# EAGLE design Ambient_Board_v1.1b (EAGLE 6.4)

## Sheet 1 of 4
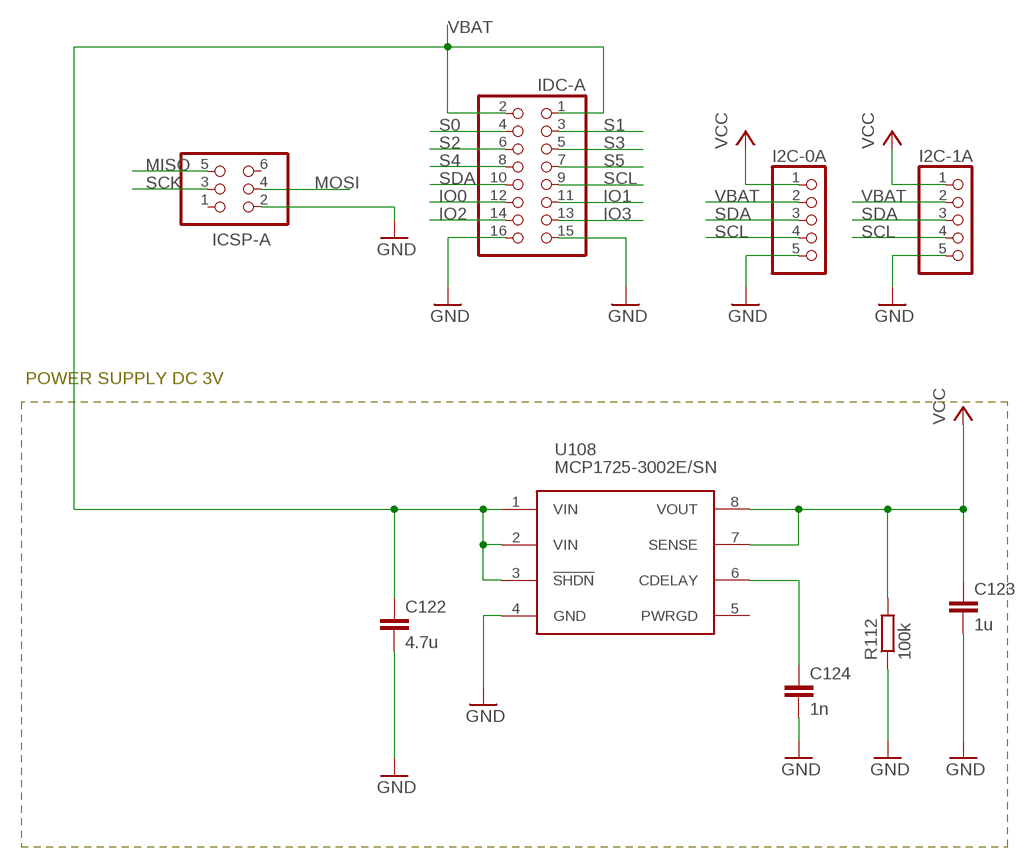
[diagram p0: schematic, sheet 1]

### Parts
C122  4.7u  C-EUC0805  [C0805]
C123  1u  C-EUC0805  [C0805]
C124  1n  C-EUC0603K  [C0603K]
I2C-0A  PINHD-1X5  [1X05]
I2C-1A  PINHD-1X5  [1X05]
ICSP-A  ICSP-A  PINHD-2X3  [2X03]
IDC-A  PINHD-2X8  [2X08]
R112  100k  R-EU_R0603  [R0603]
U108  MCP1725-3002E/SN  MCP1725  [SOIC8]

### Nets
GND: C122.2 C123.2 C124.2 I2C-0A.5 I2C-1A.5 ICSP-A.2 IDC-A.15 IDC-A.16 R112.1 U108.4(GND) ; also sheet 2,3,4
IO0: IDC-A.12 ; also sheet 3
IO1: IDC-A.11 ; also sheet 3
IO2: IDC-A.14 ; also sheet 3
IO3: IDC-A.13 ; also sheet 3
MISO: ICSP-A.5
MOSI: ICSP-A.4
N$9: C124.1 U108.6(CDELAY)
S0: IDC-A.4 ; also sheet 3
S1: IDC-A.3 ; also sheet 3
S2: IDC-A.6 ; also sheet 3
S3: IDC-A.5 ; also sheet 3
S4: IDC-A.8 ; also sheet 2
S5: IDC-A.7
SCK: ICSP-A.3
SCL: I2C-0A.4 I2C-1A.4 IDC-A.9 ; also sheet 2,3,4
SDA: I2C-0A.3 I2C-1A.3 IDC-A.10 ; also sheet 2,3,4
VBAT: C122.1 I2C-0A.2 I2C-1A.2 IDC-A.1 IDC-A.2 U108.1(VIN) U108.2(VIN) U108.3(!SHDN) ; also sheet 3
VCC [usbvcc]: C123.1 I2C-0A.1 I2C-1A.1 R112.2 U108.7(SENSE) U108.8(VOUT) ; also sheet 2,3,4
Unconnected: ICSP-A.1 ICSP-A.6 U108.5(PWRGD)

### Notes on the sheet
- POWER SUPPLY DC 3V

## Sheet 2 of 4
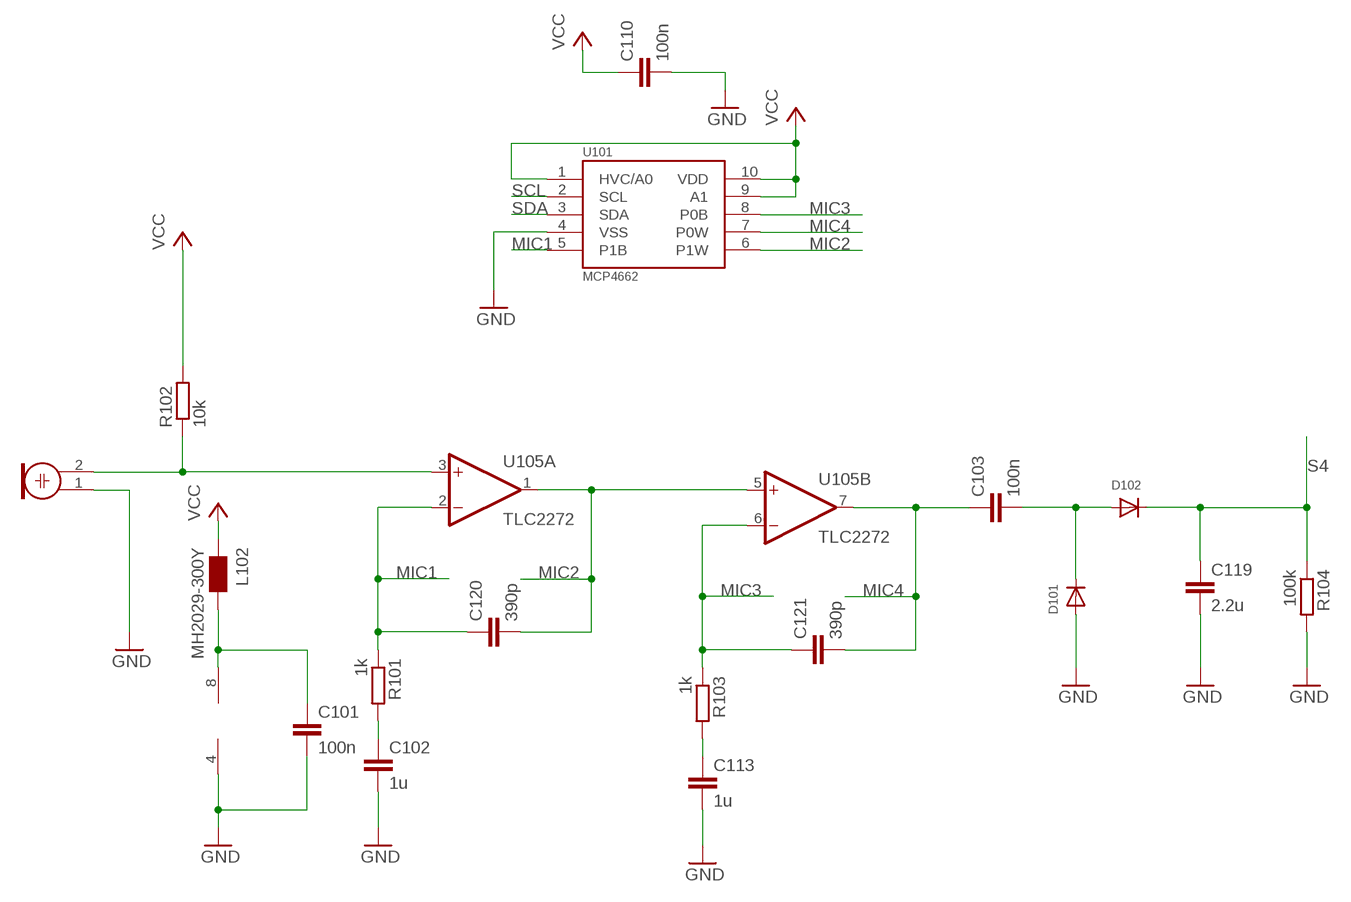
[diagram p1: schematic, sheet 2]

### Parts
C101  100n  C-EUC0603  [C0603]
C102  1u  C-EUC0805  [C0805]
C103  100n  C-EUC0603  [C0603]
C110  100n  C-EUC0603  [C0603]
C113  1u  C-EUC0805  [C0805]
C119  2.2u  C-EUC0805  [C0805]
C120  390p  C-EUC0603  [C0603]
C121  390p  C-EUC0603  [C0603]
D101  DIODESOD-323F  [SOD-323F]
D102  DIODESOD-323F  [SOD-323F]
L102  MH2029-300Y  WE-CBF_0805  [0805]
M101  POM-3044P-R  ELECTRET_MICROPHON-WM-63PR  [WM-63PR]
R101  1k  R-EU_R0603  [R0603]
R102  10k  R-EU_R0603  [R0603]
R103  1k  R-EU_R0603  [R0603]
R104  100k  R-EU_R0603  [R0603]
U101  MCP4662  [MSOP10]
U105  TLC2272  TL082D  [SO08]

### Nets
GND: C101.2 C102.2 C110.2 C113.2 C119.2 D101.A M101.1 R104.2 U101.4(VSS) U105.4(P:V-) ; also sheet 1,3,4
MIC1: C120.1 R101.1 U101.5(P1B) U105.2(A:-IN)
MIC2: C120.2 U101.6(P1W) U105.1(A:OUT) U105.5(B:+IN)
MIC3: C121.1 R103.1 U101.8(P0B) U105.6(B:-IN)
MIC4: C103.1 C121.2 U101.7(P0W) U105.7(B:OUT)
N$1: M101.2 R102.1 U105.3(A:+IN)
N$2: C102.1 R101.2
N$3: C103.2 D101.C D102.A
N$6 [usbvcc]: C101.1 L102.2 U105.8(P:V+)
N$16: C113.1 R103.2
S4: C119.1 D102.C R104.1 ; also sheet 1
SCL: U101.2(SCL) ; also sheet 1,3,4
SDA: U101.3(SDA) ; also sheet 1,3,4
VCC [usbvcc]: C110.1 L102.1 R102.2 U101.1(HVC/A0) U101.9(A1) U101.10(VDD) ; also sheet 1,3,4

## Sheet 3 of 4
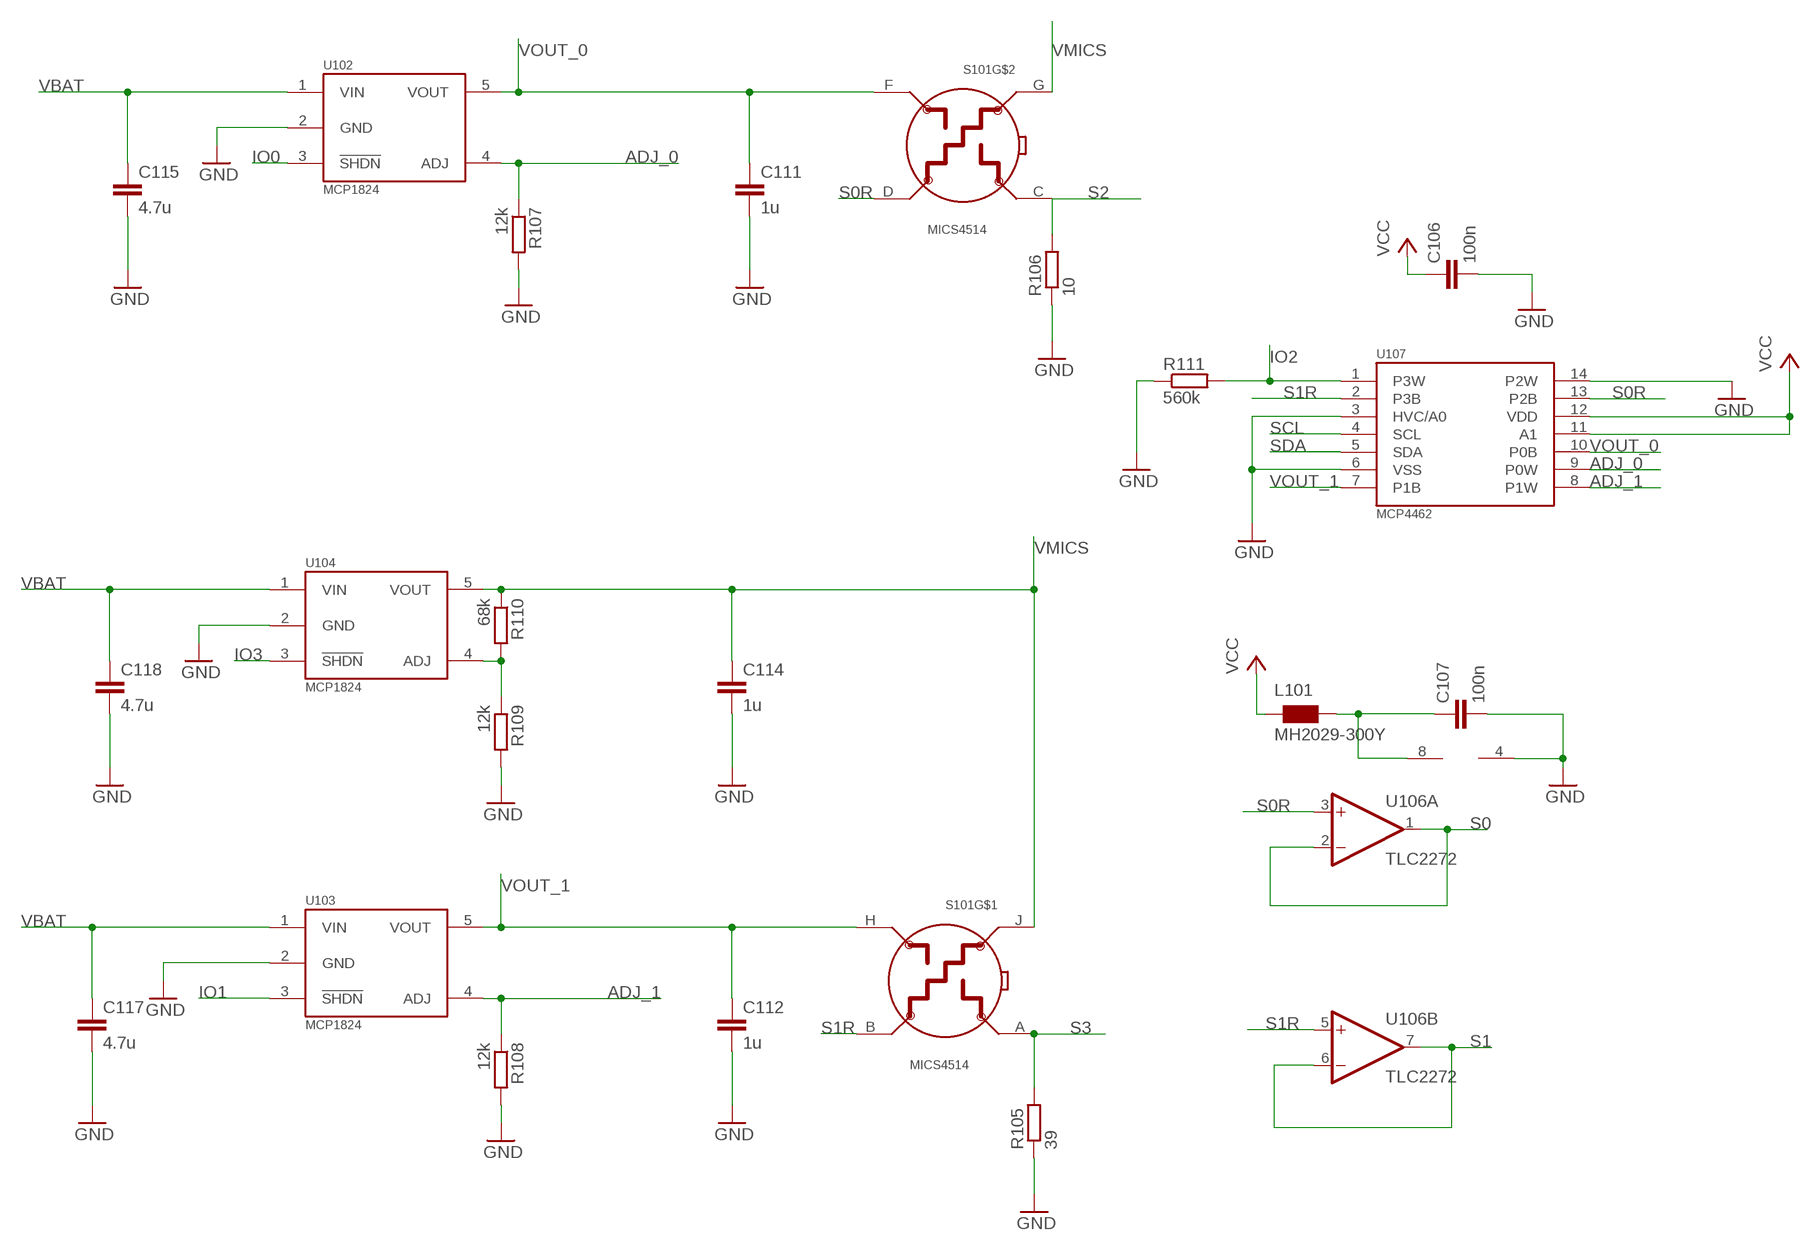
[diagram p2: schematic, sheet 3]

### Parts
C106  100n  C-EUC0603  [C0603]
C107  100n  C-EUC0603  [C0603]
C111  1u  C-EUC0805  [C0805]
C112  1u  C-EUC0805  [C0805]
C114  1u  C-EUC0805  [C0805]
C115  4.7u  C-EUC0805  [C0805]
C117  4.7u  C-EUC0805  [C0805]
C118  4.7u  C-EUC0805  [C0805]
L101  MH2029-300Y  WE-CBF_0805  [0805]
R105  39  R-EU_R0603  [R0603]
R106  10  R-EU_R0603  [R0603]
R107  12k  R-EU_R0603  [R0603]
R108  12k  R-EU_R0603  [R0603]
R109  12k  R-EU_R0603  [R0603]
R110  68k  R-EU_R0603  [R0603]
R111  560k  R-EU_R0603  [R0603]
S101  MICS4514  [MICS_SMD]
U102  MCP1824  TC1071  [SOT23-5L]
U103  MCP1824  TC1071  [SOT23-5L]
U104  MCP1824  TC1071  [SOT23-5L]
U106  TLC2272  TL082D  [SO08]
U107  MCP4462  [TSSOP14]

### Nets
ADJ_0: R107.1 U102.4(ADJ) U107.9(P0W)
ADJ_1: R108.1 U103.4(ADJ) U107.8(P1W)
GND: C106.2 C107.2 C111.2 C112.2 C114.2 C115.2 C117.2 C118.2 R105.1 R106.1 R107.2 R108.2 R109.2 R111.1 U102.2(GND) U103.2(GND) U104.2(GND) U106.4(P:V-) U107.3(HVC/A0) U107.6(VSS) U107.14(P2W) ; also sheet 1,2,4
IO0: U102.3(!SHDN) ; also sheet 1
IO1: U103.3(!SHDN) ; also sheet 1
IO2: R111.2 U107.1(P3W) ; also sheet 1
IO3: U104.3(!SHDN) ; also sheet 1
N$7 [usbvcc]: C107.1 L101.2 U106.8(P:V+)
N$11: R109.1 R110.2 U104.4(ADJ)
S0: U106.1(A:OUT) U106.2(A:-IN) ; also sheet 1
S0R: S101.D U106.3(A:+IN) U107.13(P2B)
S1: U106.6(B:-IN) U106.7(B:OUT) ; also sheet 1
S1R: S101.B U106.5(B:+IN) U107.2(P3B)
S2: R106.2 S101.C ; also sheet 1
S3: R105.2 S101.A ; also sheet 1
SCL: U107.4(SCL) ; also sheet 1,2,4
SDA: U107.5(SDA) ; also sheet 1,2,4
VBAT: C115.1 C117.1 C118.1 U102.1(VIN) U103.1(VIN) U104.1(VIN) ; also sheet 1
VCC [usbvcc]: C106.1 L101.1 U107.11(A1) U107.12(VDD) ; also sheet 1,2,4
VMICS: C114.1 R110.1 S101.G S101.J U104.5(VOUT)
VOUT_0: C111.1 S101.F U102.5(VOUT) U107.10(P0B)
VOUT_1: C112.1 S101.H U103.5(VOUT) U107.7(P1B)

## Sheet 4 of 4
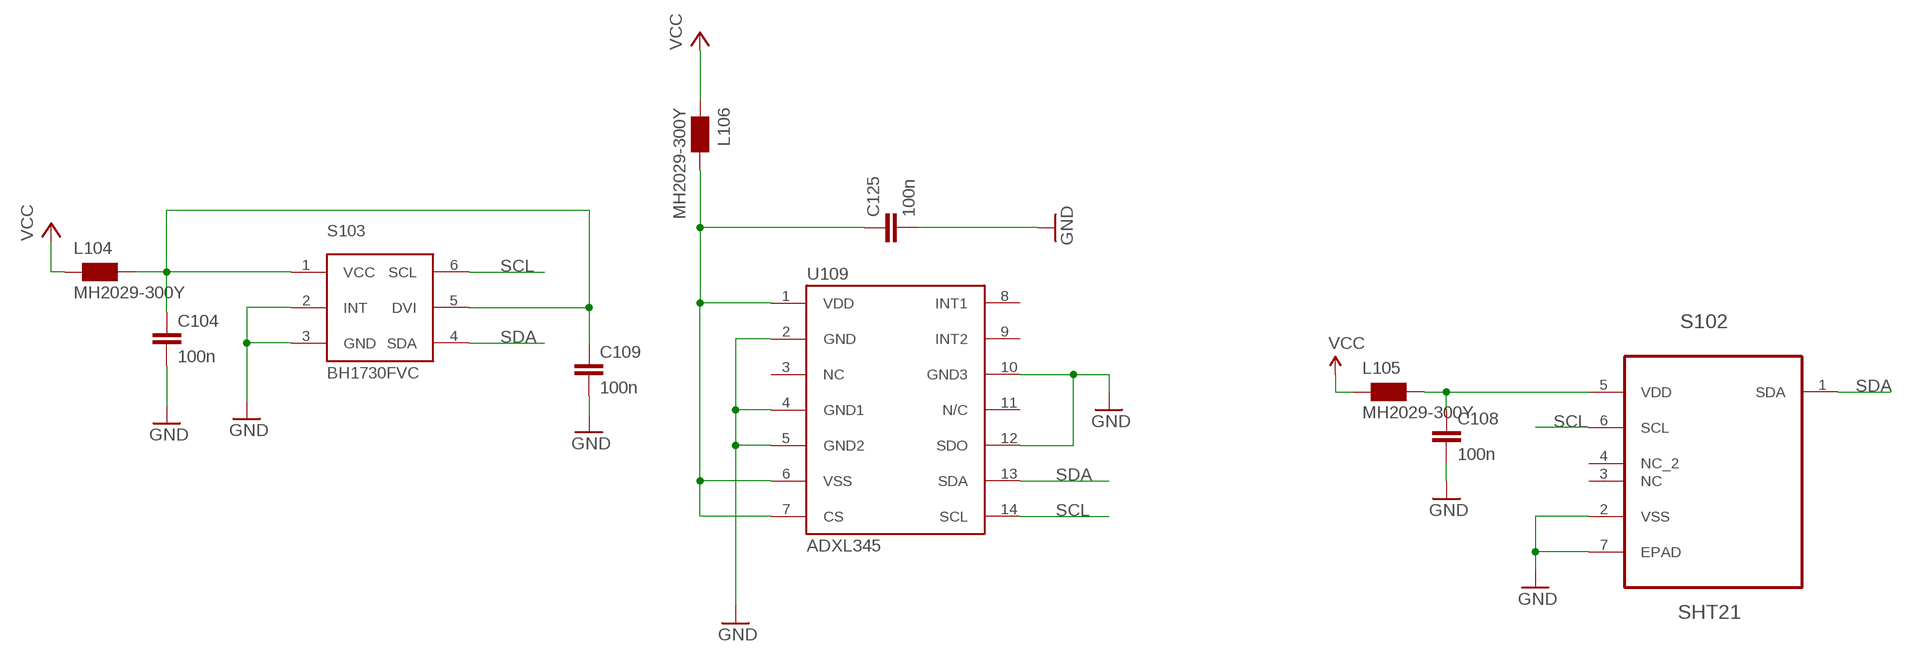
[diagram p3: schematic, sheet 4]

### Parts
C104  100n  C-EUC0603  [C0603]
C108  100n  C-EUC0603  [C0603]
C109  100n  C-EUC0603  [C0603]
C125  100n  C-EUC0603  [C0603]
L104  MH2029-300Y  WE-CBF_0805  [0805]
L105  MH2029-300Y  WE-CBF_0805  [0805]
L106  MH2029-300Y  WE-CBF_0805  [0805]
S102  SHT21  [DFN300X300X110-7N]
S103  BH1730FVC  [WSOF6]
U109  ADXL345  [LGA14]

### Nets
GND: C104.2 C108.2 C109.2 C125.2 S102.2(VSS) S102.7(EPAD) S103.2(INT) S103.3(GND) U109.2(GND) U109.4(GND1) U109.5(GND2) U109.10(GND3) U109.12(SDO) ; also sheet 1,2,3
N$4 [usbvcc]: C125.1 L106.2 U109.1(VDD) U109.6(VSS) U109.7(CS)
N$5 [usbvcc]: C108.1 L105.2 S102.5(VDD)
N$13 [usbvcc]: C104.1 C109.1 L104.2 S103.1(VCC) S103.5(DVI)
SCL: S102.6(SCL) S103.6(SCL) U109.14(SCL) ; also sheet 1,2,3
SDA: S102.1(SDA) S103.4(SDA) U109.13(SDA) ; also sheet 1,2,3
VCC [usbvcc]: L104.1 L105.1 L106.1 ; also sheet 1,2,3
Unconnected: S102.3(NC) S102.4(NC_2) U109.3(NC) U109.8(INT1) U109.9(INT2) U109.11(N/C)

## Library data of the parts
C101-C104 C106-C115 C117-C125 = rcl:C-EU: CAPACITOR, European symbol
D101 D102 = adafruit:DIODE: Diode SMADIODE - SMA Surface Mount Package 20V 1A Schottky Diode Digikey: 641-1014-6-ND DO-1N4148 - Through Hole Small Current Diode SOD-123 20V 1 A (.5mV Vf) Schottky Diode - Digikey: MBRX120TPMSCT-ND SOD-323 10V 570mA (.38mV Vf, 3ns) Schottky Diode - Digikey: ZLLS410CT-ND SOD-523 30V 30mA Schottky Diode (RB751S-40TE61) - Digikey: RB751S-40TE61CT-ND SOT23-R/W - SOT23 Package (R = Solder Paste/Reflow Ovens, W = Hand-Soldering) BAT54Film 40V 300mA - Digikey: 497-7162-1-ND
I2C-0A I2C-1A = pinhead:PINHD-1X5: PIN HEADER
ICSP-A = SmartPrj:PINHD-2X3: PIN HEADER
IDC-A = pinhead:PINHD-2X8: PIN HEADER
L101 L102 L104-L106 = wuerth-elektronik:WE-CBF: SMD EMI Suppression Ferrite Beads - excellent anti-EMI properties - low DCR - impedances till 3000 ohms - rated current up to 6 A
M101 = microphon:ELECTRET_MICROPHON-: Electret Condenser Microphone
R101-R112 = rcl:R-EU_: RESISTOR, European symbol
S101 = Hangar:MICS4514
S102 = Hangar:SHT21: SENSOR, HUMIDITY & TEMP; MPN: SHT21; OC_FARNELL: 1855468; OC_NEWARK: 20T1172; PACKAGE: DFN-6; SUPPLIER: SENSIRION
S103 = Hangar:BH1730FVC
U101 = Hangar:MCP4662
U102-U104 = Hangar:TC1071
U105 U106 = linear:TL082: OP AMP
U107 = Hangar:MCP4462
U108 = Hangar:MCP1725
U109 = SparkFunEagle-3-30-09:ADXL345

## Net classes
0 Default: width 0.203 mm
1 power: width 0.254 mm, drill 0.6 mm, clearance 0.203 mm
2 gnd: width 0.254 mm, drill 0.6 mm, clearance 0.203 mm
3 usbvcc: width 0.254 mm, drill 0.6 mm, clearance 0.203 mm
4 aref: width 0.254 mm, drill 0.6 mm, clearance 0.203 mm

## Board
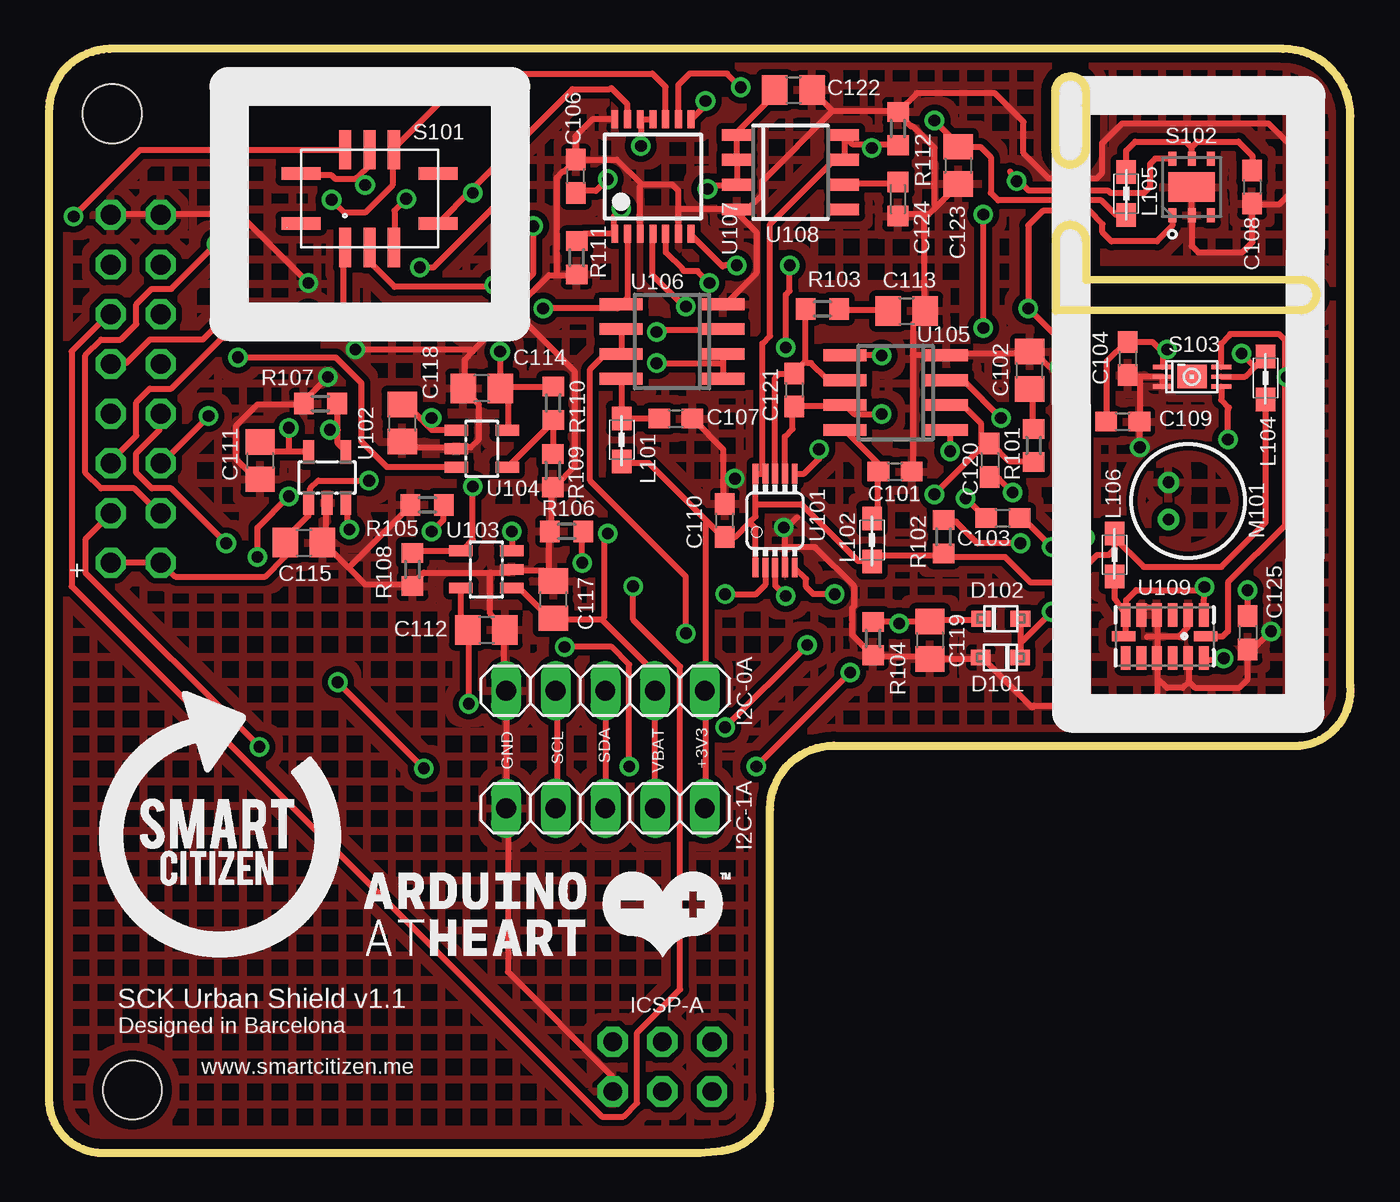
[diagram p4: board, top side]
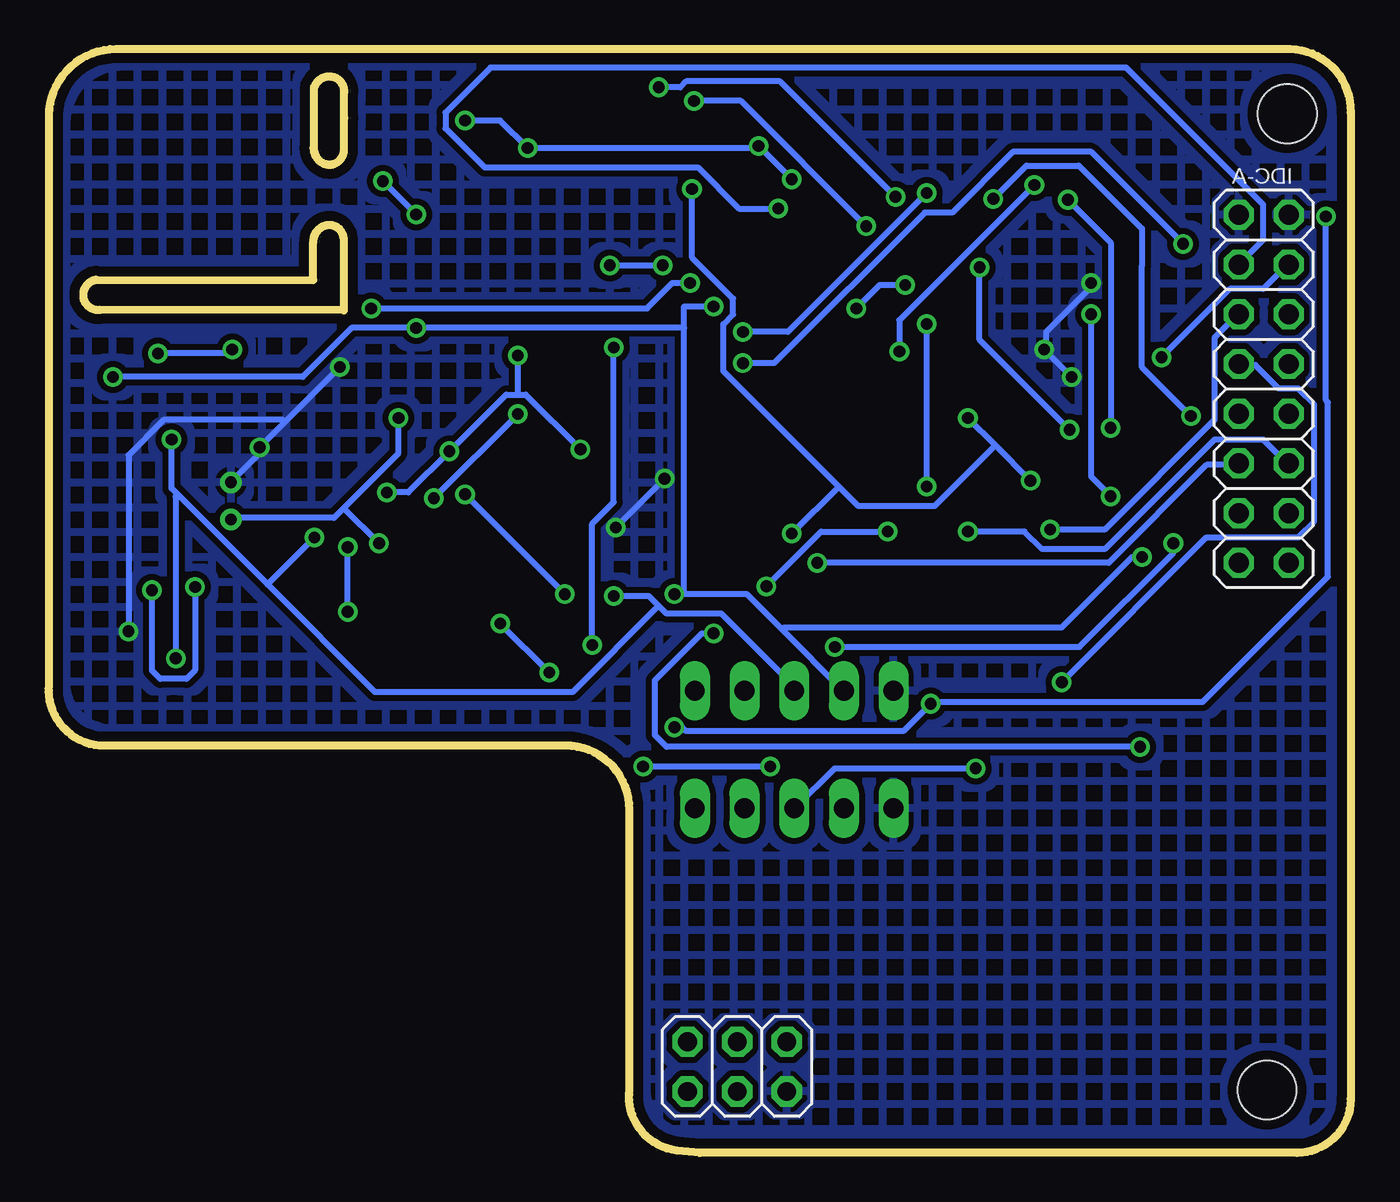
[diagram p5: board, bottom side, seen from below]

Size 66.53 x 56.41 mm. Coordinates in mm from the lower left corner, seen from the top.
Outline: 2.74,0 33.26,0 34.44,0.12 arc90 36.86,3.23 36.86,17.55 arc-90 40.12,20.81 63.95,20.81 arc90 66.52,23.89 66.52,52.98 arc90 63.09,56.41 3.09,56.41 arc90 0,53.15 0,2.74 arc90 2.74,0
Outline: 53,54.31 52.99,53.52 53.01,51.35 53,51.32 arc-90 52.14,50.49 arc-90 51.46,51.34 51.45,51.35 51.44,52.87 51.45,54.14 arc-90 52.11,55 arc-90 53,54.31
Outline: 64.09,44.61 53.02,44.6 53.02,46.55 53.01,46.59 arc90 52.15,47.42 arc90 51.47,46.56 51.47,46.56 51.47,43.05 63.92,43.07 arc90 64.78,43.76 arc90 64.09,44.61
Copper layers (1*16): Top 0.035mm / dielectric 1.5mm / Bottom 0.035mm
Design rules "default *": minimum track width 12mil, minimum drill 0.6mm, track to track 12mil, track to pad 12mil, pad to pad 8mil, via to via 6mil, smd to smd 8mil, copper to edge 20mil, drill to drill 1mm, minimum pad ring 10mil, minimum via ring 0.2mm, stop-mask expansion 4mil, vias tented up to drill 0mil, thermal gap 10mil
Holes 3 mm at 3.24,53.1 4.27,3.21

### Footprints (pad centres in the part's own frame; a part is rotated, then mirrored left to right if it is on the bottom)
C0603 = smd 1.1 x 1: 1 -0.85,0; 2 0.85,0
C0805 = smd 1.3 x 1.5: 1 -0.95,0; 2 0.95,0
C0603K = smd 1.05 x 1.08: 1 -0.875,0; 2 0.875,0
SOD-323F = smd 1 x 0.8: A -1,0; C 1,0
1X05 = drill 1.016 long: 1 -5.08,0; 2 -2.54,0; 3 0,0; 4 2.54,0; 5 5.08,0
2X03 = drill 0.95 pad 1.55 octagon: 1 -2.54,-1.27; 2 -2.54,1.27; 3 0,-1.27; 4 0,1.27; 5 2.54,-1.27; 6 2.54,1.27
2X08 = drill 1.016 octagon: 1 -8.89,-1.27; 2 -8.89,1.27; 3 -6.35,-1.27; 4 -6.35,1.27; 5 -3.81,-1.27; 6 -3.81,1.27; 7 -1.27,-1.27; 8 -1.27,1.27; 9 1.27,-1.27; 10 1.27,1.27; 11 3.81,-1.27; 12 3.81,1.27; 13 6.35,-1.27; 14 6.35,1.27; 15 8.89,-1.27; 16 8.89,1.27
0805 = smd 1.2 x 1: 1 -1.1,0; 2 1.1,0
WM-63PR = drill 0.6 pad 1: 1 -1,0.95; 2 -1,-0.95
R0603 = smd 1 x 1.1: 1 -0.85,0; 2 0.85,0
MICS_SMD = smd 0.635 x 2: A 1.25,2.5; B 0,2.5; C -1.25,2.5; F -1.25,-2.5; G 0,-2.5; H 1.25,-2.5 | smd 2 x 0.635: D -3.5,1.27; E -3.5,-1.27; J 3.5,-1.27; K 3.5,1.27
DFN300X300X110-7N = smd 0.711 x 0.406: 1 -1.448,0.991; 2 -1.448,0; 3 -1.448,-0.991; 4 1.448,-0.991; 5 1.448,0; 6 1.448,0.991 | smd 1.499 x 2.388: 7 0,0
WSOF6 = smd 0.22 x 1: 1 -0.5,-1.5; 2 0,-1.5; 3 0.5,-1.5; 4 0.5,1.5; 5 0,1.5; 6 -0.5,1.5 | smd 1.2 x 1.5: P$1 0,0
MSOP10 = smd 0.3 x 1.02: 1 -1,-2.4; 2 -0.5,-2.4; 3 0,-2.4; 4 0.5,-2.4; 5 1,-2.4; 6 1,2.4; 7 0.5,2.4; 8 0,2.4; 9 -0.5,2.4; 10 -1,2.4
SOT23-5L = smd 0.55 x 1.2: 1 -0.95,-1.3; 2 0,-1.3; 3 0.95,-1.3; 4 0.95,1.3; 5 -0.95,1.3
SO08 = smd 0.6 x 2.2: 1 -1.905,-2.6; 2 -0.635,-2.6; 3 0.635,-2.6; 4 1.905,-2.6; 5 1.905,2.6; 6 0.635,2.6; 7 -0.635,2.6; 8 -1.905,2.6
TSSOP14 = smd 0.35 x 0.9: 1 -1.95,-2.925; 2 -1.3,-2.925; 3 -0.65,-2.925; 4 0,-2.925; 5 0.65,-2.925; 6 1.3,-2.925; 7 1.95,-2.925; 8 1.95,2.925; 9 1.3,2.925; 10 0.65,2.925; 11 0,2.925; 12 -0.65,2.925; 13 -1.3,2.925; 14 -1.95,2.925
SOIC8 = smd 0.6 x 1.5: 1 -1.905,-2.75; 2 -0.635,-2.75; 3 0.635,-2.75; 4 1.905,-2.75; 5 1.905,2.75; 6 0.635,2.75; 7 -0.635,2.75; 8 -1.905,2.75
LGA14 = smd 0.5 x 1.2: 1 2,1.1; 2 1.2,1.1; 3 0.4,1.1; 4 -0.4,1.1; 5 -1.2,1.1; 6 -2,1.1; 8 -2,-1.1; 9 -1.2,-1.1; 10 -0.4,-1.1; 11 0.4,-1.1; 12 1.2,-1.1; 13 2,-1.1 | smd 1.2 x 0.5: 7 -2.1,0; 14 2.1,0

### Placement (x,y rotation side)
C101  43.25,34.81 0 top
C102  50.13,39.99 90 top
C103  48.76,32.44 0 top
C104  55.14,40.59 270 top
C106  26.94,49.91 90 top
C107  32.04,37.52 0 top
C108  61.5,49.36 270 top
C109  54.89,37.37 0 top
C110  34.55,32.31 90 top
C111  10.8,35.37 270 top
C112  22.36,26.72 0 top
C113  43.84,43.02 0 top
C114  22.13,39.06 180 top
C115  13.03,31.18 0 top
C117  25.79,28.27 90 top
C118  18.06,37.29 270 top
C119  45.03,26.2 270 top
C120  48.09,35.39 270 top
C121  38.09,38.98 270 top
C122  38.06,54.31 0 top
C123  46.48,50.46 270 top
C124  43.4,48.73 270 top
C125  61.27,26.58 270 top
D101  48.63,25.31 0 top
D102  48.65,27.29 180 top
I2C-0A  28.44,23.61 180 top
I2C-1A  28.44,17.61 180 top
ICSP-A  31.35,4.41 180 bottom
IDC-A  4.44,39.04 90 bottom
L101  29.27,36.43 90 top
L102  42.08,31.31 90 top
L104  62.19,39.6 90 top
L105  55.07,49.01 90 top
L106  54.47,30.56 270 top
M101  58.23,33.31 0 top
R101  50.33,36.14 90 top
R102  45.73,31.48 270 top
R103  39.54,43.12 0 top
R104  42.13,26.28 270 top
R105  19.34,33.11 0 top
R106  26.46,31.76 0 top
R107  13.88,38.28 180 top
R108  18.59,29.81 270 top
R109  25.76,34.86 270 top
R110  25.78,38.31 270 top
R111  26.98,45.74 90 top
R112  43.4,52.33 270 top
S101  16.39,48.76 180 top
S102  58.41,49.35 90 top
S103  58.43,39.66 270 top
U101  37.12,32.31 0 top
U102  14.22,34.51 0 top
U103  22.36,29.81 90 top
U104  22.13,35.98 270 top
U105  43.28,38.84 90 top
U106  31.85,41.46 90 top
U107  30.88,49.89 0 top
U108  37.91,50.11 270 top
U109  57.03,26.39 0 top

### Tracks (layer width: path | path; a pad name or v marks a point on that pad's centre or on a via)
ADJ_0  (via drill 0.6)
  Top 0.305: U107.9 32.18,54.57 32.76,55.15 34.66,55.15 v35.36,54.45 | 14.76,36.95 14.76,36.25 15.16,35.85 U102.4 | 14.76,36.95 14.76,38.25 R107.1 | v23.26,48.85 19.66,45.25 v18.96,45.25 | 14.76,36.95 v14.36,36.95
  Bottom 0.305: v35.36,54.45 34.26,54.45 33.96,54.75 29.16,54.75 v23.26,48.85 | v18.96,45.25 18.96,41.55 v14.36,36.95
ADJ_1  (via drill 0.6)
  Top 0.305: U107.8 32.84,52.81 33.67,53.64 v33.56,53.75 | R108.1 18.66,30.75 20.96,30.75 U103.4 21.16,30.85 21.66,31.35 v21.66,34.05 | v24.76,47.35 24.76,44.95 22.16,42.35 v21.66,42.35
  Bottom 0.305: v33.56,53.75 31.16,53.75 v24.76,47.35 | v21.66,34.05 v21.66,42.35
GND  (via drill 0.6)
  Top 0.305: U101.4 37.62,30.95 | 37.62,30.95 37.62,31.86 | 37.62,31.86 38.24,32.48 | U107.14 27.79,52.81 26.92,51.94 26.92,50.78 C106.2 | C106.2 29.01,50.76 30.29,49.48 | U107.3 30.23,49.42 30.29,49.48 | U107.6 32.18,48.25 | 32.18,48.25 32.18,49.16 31.86,49.47 30.3,49.47 30.29,49.48 | 34.46,34.45 34.46,35.95 32.96,37.45 C107.2 | 34.46,34.45 34.46,33.25 C110.2 | 37.62,30.95 39.16,30.95 41.16,28.95 41.16,27.95 41.06,27.85 41.06,26.45 42.06,25.45 R104.2 42.16,25.35 44.96,25.35 C119.2 45.06,25.25 47.56,25.25 D101.A 47.76,25.25 50.26,22.75 50.36,22.85 56.06,22.85 56.66,23.45 56.66,24.26 | v35.06,34.45 34.46,34.45 | v37.56,31.95 37.62,31.86 | 40.06,53.25 43.36,53.25 R112.1 | 40.06,53.25 39.06,54.25 C122.2 | 44.76,47.95 44.96,47.95 45.36,48.35 | 44.76,47.95 43.46,47.95 C124.2 | 45.36,48.35 46.46,49.45 C123.2 46.56,49.35 | 44.16,40.75 44.16,42.35 44.76,42.95 C113.2 44.76,43.15 44.76,47.95 | 44.16,40.75 44.16,34.85 C101.2 | R112.1 43.46,53.05 44.06,52.45 44.16,52.45 45.26,51.35 45.26,48.45 45.36,48.35 | C102.2 50.06,40.85 45.96,40.85 U105.4 45.76,40.75 44.16,40.75 | 50.36,40.95 50.26,40.95 C102.2 | 15.31,29.9 14.06,31.15 C115.2 14.16,31.25 14.16,33.15 U102.2 | 15.31,29.9 16.16,29.05 18.56,29.05 R108.2 18.66,29.15 19.16,29.65 22.56,29.65 | 15.31,29.9 18.46,33.05 R105.1 | 22.56,29.65 23.56,29.65 U103.2 23.66,29.75 25.26,29.75 25.76,29.25 C117.2 25.56,29.65 25.56,31.65 R106.1 25.66,31.85 25.66,33.95 R109.2 25.86,34.05 26.86,35.05 26.86,39.95 23.76,43.05 | ICSP-A.2 28.76,3.15 28.76,3.95 23.46,9.25 23.46,17.55 I2C-1A.5 23.36,17.65 23.36,23.45 I2C-0A.5 23.26,23.65 23.26,26.65 C112.2 23.26,26.85 22.56,27.55 22.56,29.65
  Top 0.305: IDC-A.15 3.26,47.95 5.66,47.95 IDC-A.16 5.86,47.95 9.76,47.95 v13.26,44.45 | C111.2 10.76,34.45 10.56,34.45 9.56,35.45 9.56,37.15 10.66,38.25 12.96,38.25 R107.2 13.16,38.35 13.16,38.55 v14.26,39.65 | C118.2 18.06,36.25 18.26,36.05 20.76,36.05 U104.2 20.96,36.05 21.56,36.05 21.96,36.45 21.96,38.25 21.26,38.95 C114.2 21.26,39.15 21.26,40.55 21.66,40.95 | 32.18,48.25 35.06,48.25 U108.4 | 25.96,44.85 25.56,44.85 23.76,43.05 | 25.96,44.85 26.96,44.85 R111.1 | 21.66,40.95 23.76,43.05 | 25.96,44.85 25.96,49.85 26.26,50.15 26.36,50.15 26.86,50.65 C106.2 | U106.4 34.46,43.45 34.66,43.45 36.16,44.95 36.16,47.05 35.16,48.05 U108.4 | v15.66,41.05 21.56,41.05 21.66,40.95 | 40.06,53.25 36.46,49.65 36.46,48.95 35.46,47.95 U108.4 | 55.76,39.66 S103.2 S103.3 | 55.76,39.66 55.22,39.66 C104.2 | 61.06,25.35 61.06,25.45 61.26,25.65 C125.2 | 58.26,24.08 58.26,24.07 58.57,23.77 60.83,23.77 61.28,24.21 C125.2 | U109.12 58.26,25.55 58.26,24.08 | 56.66,26.63 56.66,27.75 U109.4 56.56,27.85 55.86,27.85 U109.5 56.06,27.95 | 56.66,26.38 56.66,25.65 U109.10 56.66,25.45 56.66,24.26 | 55.76,39.66 55.76,37.45 C109.2 55.76,37.25 v55.76,36.05 | v51.66,40.15 51.16,40.15 50.46,40.85 C102.2 | v62.46,26.65 61.66,25.85 61.36,25.85 C125.2 | S102.7 S102.2 58.41,46.35 58.74,46.02 61,46.02 61.52,46.54 61.52,48.48 | 61.52,48.48 62.9,48.48 63.45,49.03 63.45,51.49 62.35,52.59 54.85,52.59 53.85,51.59 53.85,50.09 53.54,49.79 51.11,49.79 49.81,51.09 49.81,52.68 48.35,54.14 44.36,54.14 R112.1 | 61.52,48.48 C108.2 | 56.67,26.62 56.66,26.63 | 56.68,26.37 56.12,26.37 | 56.66,26.63 56.66,26.38 | 56.66,26.38 56.68,26.37
  Top 0.305: 58.26,24.08 57.94,23.76 57.16,23.76 56.66,24.26 | U109.2 58.23,26.88 58.02,26.67 58.02,26.62 57.76,26.36 56.69,26.36 56.68,26.37
  Bottom 0.305: v37.56,31.95 v35.06,34.45 | v14.26,39.65 v15.66,41.05 15.56,41.15 15.56,41.95 13.26,44.25 v13.26,44.45 | M101.1 57.16,34.35 55.76,35.75 v55.76,36.05 54.46,37.35 | v51.66,40.15 54.46,37.35 | v62.46,26.65 62.46,35.65 60.66,37.45 54.56,37.45 54.46,37.35
  pour Top (hatched): -1.63,57.05 52.43,57.58 66.23,57.58 67.24,-0.12 -1.56,-0.74
  pour Bottom (hatched): -1.82,57.1 65.93,57.32 67.21,-0.35 -1.22,-0.57
IO0  (via drill 0.6)
  Top 0.305: v15.36,31.85 15.26,31.95 15.26,33.15 U102.3
  Bottom 0.305: v15.36,31.85 12.56,31.85 6.96,37.45 6.96,41.65 5.76,42.85 IDC-A.12
IO1  (via drill 0.6)
  Top 0.305: v23.66,31.75 23.66,30.85 U103.3 | v29.86,28.95 29.86,27.25 32.26,24.85 32.26,8.35 30.06,6.15 30.06,2.55 29.36,1.85 28.26,1.85 1.16,28.95 1.16,40.95 3.16,42.95 IDC-A.11
  Bottom 0.305: v23.66,31.75 27.06,31.75 v29.86,28.95
IO2  (via drill 0.6)
  Top 0.305: R111.2 27.36,46.96 U107.1 28.86,47.05 28.86,47.85 v29.26,48.25
  Bottom 0.305: v29.26,48.25 31.26,48.25 33.36,50.35 44.26,50.35 46.26,52.35 46.26,53.15 43.96,55.45 11.46,55.45 4.46,48.45 4.46,46.65 5.66,45.45 IDC-A.14
IO3  (via drill 0.6)
  Top 0.305: v9.66,40.65 14.66,40.65 15.96,39.35 15.96,36.35 17.26,35.05 20.76,35.05 U104.3
  Bottom 0.305: v9.66,40.65 6.16,44.15 4.46,44.15 3.26,45.35 IDC-A.13
MIC1  (via drill 0.6)
  Top 0.305: R101.1 50.26,35.35 49.06,35.35 48.16,36.25 C120.1 | v40.16,28.55 39.07,28.55 38.7,28.92 38.7,29.33 U101.5 | v45.26,33.65 47.86,36.25 47.96,36.25 C120.1 | U105.2 45.96,38.15 46.76,38.15 47.66,37.25 47.66,36.25 C120.1
  Bottom 0.305: v45.26,33.65 v40.16,28.55
MIC2  (via drill 0.6)
  Top 0.305: U101.6 38.61,34.71 39.29,35.39 39.36,35.45 v39.36,35.95 | v49.26,33.75 48.56,34.45 48.16,34.45 C120.2 | v46.06,35.85 46.06,36.75 45.96,36.85 U105.1 | v42.56,40.75 40.76,40.75 U105.5
  Bottom 0.305: v49.26,33.75 48.16,33.75 v46.06,35.85 43.16,38.75 42.56,38.75 | v39.36,35.95 42.16,38.75 42.56,38.75 | 42.56,38.75 v42.56,40.75
MIC3
  Top 0.305: U101.8 37.12,39.6 37.32,39.8 38.06,39.8 C121.1 38.16,39.95 38.66,40.45 | 38.66,40.45 38.66,43.05 R103.1 | 38.66,40.45 38.76,40.35 38.96,40.35 39.76,39.55 40.66,39.55 U105.6
MIC4  (via drill 0.6)
  Top 0.305: U101.7 37.62,36.6 38.01,37 38.01,38.06 C121.2 38.16,38.15 40.56,38.15 U105.7 40.76,38.15 41.16,37.75 v42.56,37.75 | v46.86,33.45 47.86,32.45 C103.1
  Bottom 0.305: v42.56,37.75 v46.86,33.45
N$1  (via drill 0.6)
  Top 0.305: v49.66,31.15 47.46,31.15 46.36,32.25 45.76,32.25 R102.1 | v48.66,37.55 46.76,39.45 45.96,39.45 U105.3
  Bottom 0.305: v48.66,37.55 48.66,35.75 51.46,32.95 | 51.46,32.95 51.96,32.45 57.16,32.45 M101.2 | 51.46,32.95 v49.66,31.15
N$2
  Top 0.305: R101.2 50.26,37.05 50.26,38.85 50.16,38.95 C102.1
N$3  (via drill 0.6)
  Top 0.305: 49.66,26.15 49.66,27.25 D102.A 49.76,27.05 | 49.66,26.15 49.66,25.35 D101.C | 49.66,32.35 C103.2 49.76,32.25 49.96,32.25 v51.26,30.95 | v51.26,27.65 49.76,26.15 49.66,26.15
  Bottom 0.305: v51.26,27.65 v51.26,30.95
N$4  (via drill 0.6)
  Top 0.305: U109.7 55.05,26.65 U109.6 | L106.2 54.47,28.33 U109.6 | U109.1 59.05,29.11 59.04,29.12 v59.06,28.92 | U109.6 55.06,27.76 55.06,28.24 55.57,28.76 58.9,28.76 v59.06,28.92 | C125.1 61.27,28.6 v61.26,28.75 | 59.04,29.13 v59.06,28.92
  Bottom 0.305: v61.26,28.75 61.26,24.64 61.27,24.64 60.84,24.22 59.5,24.22 59.06,24.66 v59.06,28.92
N$5
  Top 0.305: L105.2 55.07,51.21 55.52,51.66 58.1,51.66 58.39,51.38 58.39,50.82 S102.5 58.41,51.38 58.69,51.66 60.8,51.66 61.52,50.94 61.52,50.23 C108.1
N$6
  Top 0.305: L102.2 42.16,32.45 42.36,32.65 42.36,34.75 C101.1 42.36,34.95 42.36,35.25 40.76,36.85 U105.8
N$7
  Top 0.305: C107.1 31.16,37.55 29.36,37.55 L101.2 29.26,37.65 U106.8
N$9
  Top 0.305: C124.1 43.36,49.55 40.66,49.55 U108.6
N$11
  Top 0.305: R109.1 25.76,35.75 R110.2 25.66,37.25 23.46,35.05 U104.4
N$13  (via drill 0.6)
  Top 0.305: 56.93,40.92 56.4,41.44 C104.1 55.06,41.45 54.06,40.45 54.06,37.45 C109.1 | 56.93,40.92 S103.1 | S103.5 61.15,39.66 61.65,40.16 | 61.65,40.16 L104.2 | v60.96,40.85 61.65,40.16 | v57.16,41.05 57.06,40.95 56.93,40.92
  Bottom 0.305: v60.96,40.85 57.36,40.85 v57.16,41.05
N$16
  Top 0.305: R103.2 40.46,43.05 42.86,43.05 C113.1
S0  (via drill 0.6)
  Top 0.305: 34.46,40.35 34.46,40.75 U106.2 | 34.46,40.35 34.46,39.65 U106.1 | v31.06,40.35 34.46,40.35 | v8.56,46.45 6.26,44.15 5.26,44.15 4.46,43.35 4.46,42.35 3.66,41.55 2.66,41.55 1.86,40.75 1.86,34.75 2.66,33.95 4.36,33.95 5.66,32.65 IDC-A.4
  Bottom 0.305: v31.06,40.35 29.46,40.35 21.76,48.05 20.36,48.05 17.26,51.15 13.26,51.15 v8.56,46.45
S0R  (via drill 0.6)
  Top 0.305: U107.13 29.58,53.59 28.76,54.41 28.66,54.35 26.76,54.35 21.56,49.15 | 21.56,49.15 19.96,47.55 S101.D | v31.06,41.95 31.16,42.05 34.36,42.05 U106.3 | v21.66,49.05 21.56,49.15
  Bottom 0.305: v31.06,41.95 28.76,41.95 v21.66,49.05
S1  (via drill 0.6)
  Top 0.305: U106.6 29.26,42.05 29.26,40.85 U106.7 29.16,40.75 28.36,40.75 27.66,40.05 27.66,34.35 32.56,29.45 v32.56,26.55 | v10.76,20.75 1.86,29.65 1.86,31.35 3.16,32.65 IDC-A.3
  Bottom 0.305: v32.56,26.55 33.16,26.55 35.56,24.15 35.56,21.35 34.96,20.75 v10.76,20.75
S1R  (via drill 0.6)
  Top 0.305: U107.2 29.58,43.69 U106.5 29.16,43.25 29.06,43.15 v25.26,43.15 | v22.76,44.35 22.66,44.25 17.66,44.25 16.46,45.45 16.46,46.25 S101.B
  Bottom 0.305: v22.76,44.35 24.06,44.35 v25.26,43.15
S2  (via drill 0.6)
  Top 0.305: v27.26,30.15 27.26,31.75 R106.2 | v18.26,48.75 17.66,48.15 17.66,46.35 S101.C | v8.16,37.65 5.76,35.25 IDC-A.6
  Bottom 0.305: v27.26,30.15 12.36,30.15 7.36,35.15 5.76,35.15 IDC-A.6 | v18.26,48.75 16.56,50.45 13.89,50.45 10.66,47.22 10.66,45.35 10.66,40.15 v8.16,37.65
S3  (via drill 0.6)
  Top 0.305: v19.56,31.75 20.16,32.35 20.16,33.05 R105.2 | S101.A 15.06,46.25 15.06,43.25 13.46,41.65 8.86,41.65 6.26,39.05 5.16,39.05 4.46,38.35 4.46,36.65 3.26,35.45 3.26,35.25 IDC-A.5
  Bottom 0.305: v19.56,31.75 16.66,31.75 15.76,30.85 12.56,30.85 6.96,36.45 4.46,36.45 3.26,35.25 IDC-A.5
S4  (via drill 0.6)
  Top 0.305: D102.C 47.56,27.25 45.16,27.25 45.06,27.15 C119.1 44.96,27.15 43.46,27.15 | 43.46,27.15 42.16,27.15 R104.1 | v9.06,31.15 6.26,33.95 5.26,33.95 4.46,34.75 4.46,35.75 5.66,36.95 5.66,37.75 IDC-A.8 | v26.36,25.85 28.76,25.85 29.66,24.95 v29.66,19.75 | v40.96,24.55 v36.16,19.75 | v43.46,27.05 43.46,27.15
  Bottom 0.305: v9.06,31.15 9.06,30.65 13.86,25.85 v26.36,25.85 | v36.16,19.75 v29.66,19.75 | v43.46,27.05 v40.96,24.55
SCL  (via drill 0.6)
  Top 0.305: v32.56,43.25 32.46,43.25 30.86,44.85 30.86,46.95 U107.4 | I2C-1A.4 25.96,17.65 25.96,23.55 I2C-0A.4 | v13.26,42.85 9.16,42.85 7.86,41.55 5.16,41.55 3.96,40.35 3.26,40.35 IDC-A.9 | v12.26,33.55 10.66,31.95 v10.66,30.45 | S103.6 59.93,41.35 60.32,41.74 60.36,41.85 62.86,41.85 63.16,41.55 63.16,39.65 | 63.16,39.65 63.16,32.05 60.26,29.15 60.26,26.65 60,26.39 U109.14 | v63.26,39.65 63.16,39.65 | S102.6 56.55,50.8 56.28,50.52 56.28,49.33 56.06,49.12 56.05,49.12 55.97,49.05 54.26,49.05 54.12,49.18 50.08,49.18 49.54,49.72 | 49.54,49.72 49.12,50.14 | v47.76,42.15 v47.76,47.95 | v49.46,49.65 49.54,49.72 | U101.2 36.62,29.03 36.12,28.53 34.59,28.53 v34.56,28.55
  Bottom 0.305: v32.56,43.25 34.06,43.25 34.06,42.15 | 34.06,28.55 30.86,28.55 29.06,26.75 | 34.06,28.55 v34.56,28.55 | 29.06,26.75 25.96,23.65 I2C-0A.4 | v13.26,42.85 13.26,34.55 v12.26,33.55 | v10.66,30.45 11.16,30.45 14.76,26.85 28.96,26.85 29.06,26.75 | 34.06,28.55 34.06,42.15 | v63.26,39.65 53.56,39.65 51.06,42.15 v47.76,42.15 34.06,42.15 | v47.76,47.95 v49.46,49.65
SDA  (via drill 0.6)
  Top 0.305: I2C-1A.3 28.46,17.65 28.46,23.55 I2C-0A.3 | v19.16,19.65 v14.76,24.05 | S103.4 59.93,38.47 60.32,38.07 60.26,37.95 v60.26,36.45 | U107.5 31.53,46.02 32.38,45.16 32.46,45.05 33.16,45.05 v33.76,44.45 | 59.06,25.65 U109.13 59.16,25.17 59.95,25.17 v60.05,25.27 | v50.06,43.15 52.96,40.25 v52.96,31.45 | S102.1 57.42,47.36 56.64,46.58 54.31,46.58 53.86,47.03 53.86,47.46 53.18,48.13 50.8,48.13 50.06,47.39 v50.06,43.15 | v50.06,43.15 | U101.3 37.12,28.99 v37.66,28.45
  Bottom 0.305: v37.66,28.45 35.86,28.45 35.36,27.95 | 35.36,27.95 34.96,27.55 32.16,27.55 28.46,23.85 28.46,23.65 I2C-0A.3 | v14.76,24.05 7.36,31.45 2.66,31.45 1.86,32.25 1.86,38.25 2.66,39.05 3.66,39.05 4.86,40.25 5.66,40.25 IDC-A.10 | v19.16,19.65 26.36,19.65 28.36,17.65 I2C-1A.3 | 35.36,27.95 39.76,23.55 49.86,23.55 55.36,29.05 | v60.26,36.45 60.26,33.95 59.96,33.65 | 55.36,29.05 59.96,33.65 | v60.05,25.27 60.06,33.55 59.96,33.65 | v33.76,44.45 34.66,44.45 35.96,43.15 v50.06,43.15 | 55.36,29.05 v52.96,31.45
VBAT  (via drill 0.6)
  Top 0.305: U103.1 24.06,28.85 25.56,27.35 25.76,27.35 C117.1 25.86,27.25 28.26,27.25 | 28.26,27.25 30.96,24.55 30.96,23.65 I2C-0A.2 30.96,23.55 30.96,17.65 I2C-1A.2 | C122.1 37.06,54.25 37.06,54.05 35.16,52.15 U108.1 35.16,51.95 35.16,50.85 U108.2 35.16,50.65 35.16,49.55 U108.3 35.06,49.45 33.86,49.45 v33.66,49.25 | 19.26,37.25 18.36,38.15 18.06,38.15 C118.1 | 19.26,37.25 19.56,36.95 20.76,36.95 U104.1 | v19.56,37.55 19.26,37.25 | v16.36,34.35 13.76,34.35 13.36,33.95 13.36,33.35 U102.1 13.26,33.15 13.26,32.55 12.16,31.45 12.16,31.25 C115.1 12.06,31.05 12.06,30.45 11.06,29.45 6.46,29.45 5.76,30.15 IDC-A.2 5.56,30.15 3.26,30.15 IDC-A.1 | v28.56,31.65 28.36,31.45 28.36,27.35 28.26,27.25
  Bottom 0.305: v16.36,34.35 18.16,36.15 | 18.16,36.15 v19.56,37.55 | v33.66,49.25 33.66,45.75 31.56,43.65 31.56,42.85 32.06,42.35 32.06,39.95 26.16,34.05 | 26.16,34.05 25.16,33.05 21.26,33.05 18.16,36.15 | 26.16,34.05 v28.56,31.65
VCC  (via drill 0.6)
  Top 0.305: 35.82,32.21 35.07,31.46 C110.1 34.46,31.45 33.66,32.25 | 35.82,32.21 36.12,32.51 36.12,33.15 | 36.12,33.15 U101.10 36.46,34.71 | 36.46,34.71 U101.9 | U101.1 36.12,31.92 35.82,32.21 | U107.11 U107.12 30.26,52.75 v30.26,51.45 | I2C-1A.1 33.56,17.65 33.56,23.55 I2C-0A.1 33.56,23.75 33.56,32.15 33.66,32.25 | v28.56,49.75 27.96,49.15 26.96,49.15 C106.1 | 42.06,51.55 41.06,51.55 40.66,51.95 U108.8 40.66,51.75 U108.7 40.56,50.65 40.06,50.65 36.86,47.45 36.86,41.75 36.46,41.35 36.46,34.71 | 42.06,51.55 43.36,51.55 R112.2 | 33.66,32.25 30.66,35.25 29.36,35.25 L101.1 | v42.06,51.35 42.06,51.55 | v45.26,52.75 46.46,51.55 C123.1 47.61,51.41 48.15,50.88 48.15,49.05 48.52,48.67 53.81,48.67 54.56,47.91 L105.1 | 36.12,33.15 38.46,33.15 41.36,30.25 41.96,30.25 L102.1 42.16,30.25 42.46,30.55 45.66,30.55 R102.2 45.76,30.45 48.87,30.45 50.17,29.15 52.18,29.15 53.58,30.55 54.18,30.55 54.49,30.86 54.49,31.64 L106.1 54.47,31.43 55.95,29.95 59.93,29.95 62.19,32.2 L104.1
  Bottom 0.305: v28.56,49.75 v30.26,51.45 30.36,51.35 v42.06,51.35 43.46,52.75 v45.26,52.75
VMICS  (via drill 0.6)
  Top 0.305: R110.1 23.16,39.15 C114.1 | U104.5 23.46,36.95 23.46,39.05 C114.1 | 15.76,49.85 16.36,50.45 16.36,51.25 S101.G | 15.76,49.85 15.66,49.75 14.66,49.75 14.46,49.95 12.96,49.95 S101.J | v23.06,40.95 23.06,39.25 C114.1 | 15.76,49.85 v16.16,49.45
  Bottom 0.305: v23.06,40.95 23.06,42.55 v16.16,49.45
VOUT_0  (via drill 0.6)
  Top 0.305: U107.10 31.53,54.47 30.85,55.15 21.46,55.15 17.66,51.35 S101.F 17.56,51.15 17.56,49.45 16.16,48.05 15.1,48.05 v14.45,48.7 | 12.26,35.85 11.26,35.85 10.86,36.25 C111.1 | 12.26,35.85 13.26,35.85 U102.5 | v12.26,37.05 12.26,35.85
  Bottom 0.305: v12.26,37.05 12.26,46.51 v14.45,48.7
VOUT_1  (via drill 0.6)
  Top 0.305: U107.7 32.83,46.91 34.43,45.3 34.56,45.35 v35.16,45.35 | U103.5 21.06,27.05 21.36,26.75 C112.1 21.46,26.65 v21.46,22.95 | v37.86,45.35 37.86,44.05 37.66,43.85 v37.66,41.15 | v34.56,21.75 v38.76,25.95 | v1.26,47.85 4.66,51.25 15.06,51.25 S101.H
  Bottom 0.305: v37.86,45.35 v35.16,45.35 | v37.66,41.15 37.66,33.25 38.76,32.15 v38.76,25.95 | v34.56,21.75 34.16,21.75 33.96,21.55 22.86,21.55 v21.46,22.95 21.36,23.05 7.56,23.05 1.16,29.45 1.16,38.35 1.26,38.45 v1.26,47.85

### Text on the board
tPlace: + | GND | SCL | SDA | VBAT | +3V3 | SCK Urban Shield v1.1 | Designed in Barcelona | www.smartcitizen.me